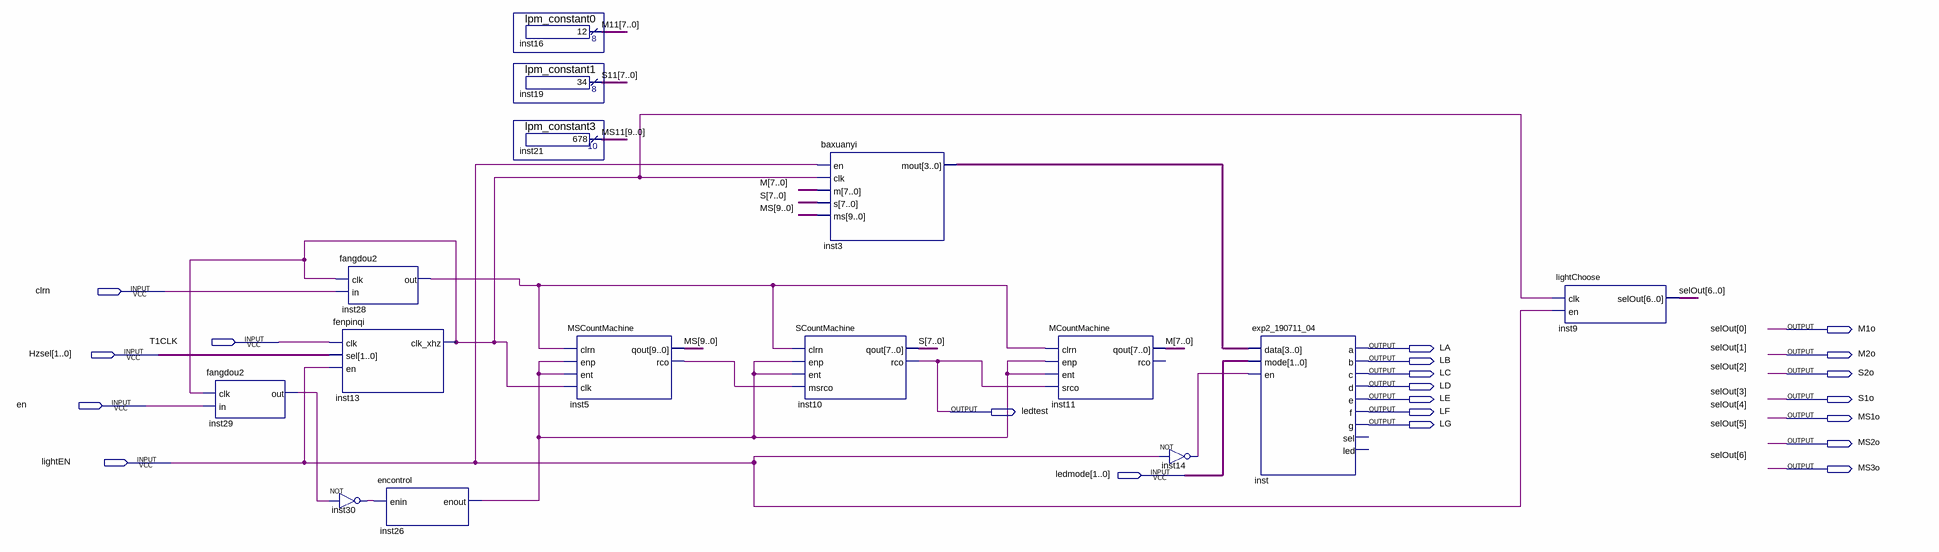
[diagram p0: schematic sheet]
// Quartus schematic g04_190711_10.bdf as structural Verilog: 15 symbols, 21 pins
module g04_190711_10 (
  input  clrn,
  input  T1CLK,
  input  [1:0] Hzsel,
  input  en,
  input  lightEN,
  input  [1:0] ledmode,
  output M1o,
  output LA,
  output M2o,
  output LB,
  output LC,
  output S2o,
  output LD,
  output LE,
  output S1o,
  output ledtest,
  output LF,
  output MS1o,
  output LG,
  output MS2o,
  output MS3o
);

  wire inst5_rco, inst13_clk_xhz, inst14_out, inst26_enout, inst28_out, inst29_out, inst30_out;
  wire [3:0] inst3_mout;
  wire [7:0] M, M11, S, S11;
  wire [9:0] MS, MS11;

  fangdou2 inst29 (.clk(inst13_clk_xhz), .in(en), .out(inst29_out));
  fangdou2 inst28 (.clk(inst13_clk_xhz), .in(clrn), .out(inst28_out));
  fenpinqi inst13 (.clk(T1CLK), .sel(Hzsel), .en(lightEN), .clk_xhz(inst13_clk_xhz));
  encontrol inst26 (.enin(inst30_out), .enout(inst26_enout));
  not inst30 (inst30_out, inst29_out);
  lpm_constant0 inst16 (.result(M11));
  lpm_constant1 inst19 (.result(S11));
  lpm_constant3 inst21 (.result(MS11));
  MSCountMachine inst5 (
    .clrn(inst28_out), .enp(inst26_enout), .ent(inst26_enout), .clk(inst13_clk_xhz), .qout(MS),
    .rco(inst5_rco));
  baxuanyi inst3 (.en(lightEN), .clk(inst13_clk_xhz), .m(M), .s(S), .ms(MS), .mout(inst3_mout));
  SCountMachine inst10 (
    .clrn(inst28_out), .enp(inst26_enout), .ent(inst26_enout), .msrco(inst5_rco), .qout(S), .rco(ledtest));
  MCountMachine inst11 (
    .clrn(inst28_out), .enp(inst26_enout), .ent(inst26_enout), .srco(ledtest), .qout(M));  // open: rco
  not inst14 (inst14_out, lightEN);
  exp2_190711_04 inst (
    .data(inst3_mout), .mode(ledmode), .en(inst14_out), .a(LA), .b(LB), .c(LC), .d(LD), .e(LE), .f(LF), .g(LG));  // open: sel, led
  lightChoose inst9 (.clk(inst13_clk_xhz), .en(lightEN), .selOut({MS3o, MS2o, MS1o, S1o, S2o, M2o, M1o}));

  // Other names for the same wires on the sheet: selOut[6:0] = {MS3o, MS2o, MS1o, S1o, S2o, M2o, M1o}
endmodule
